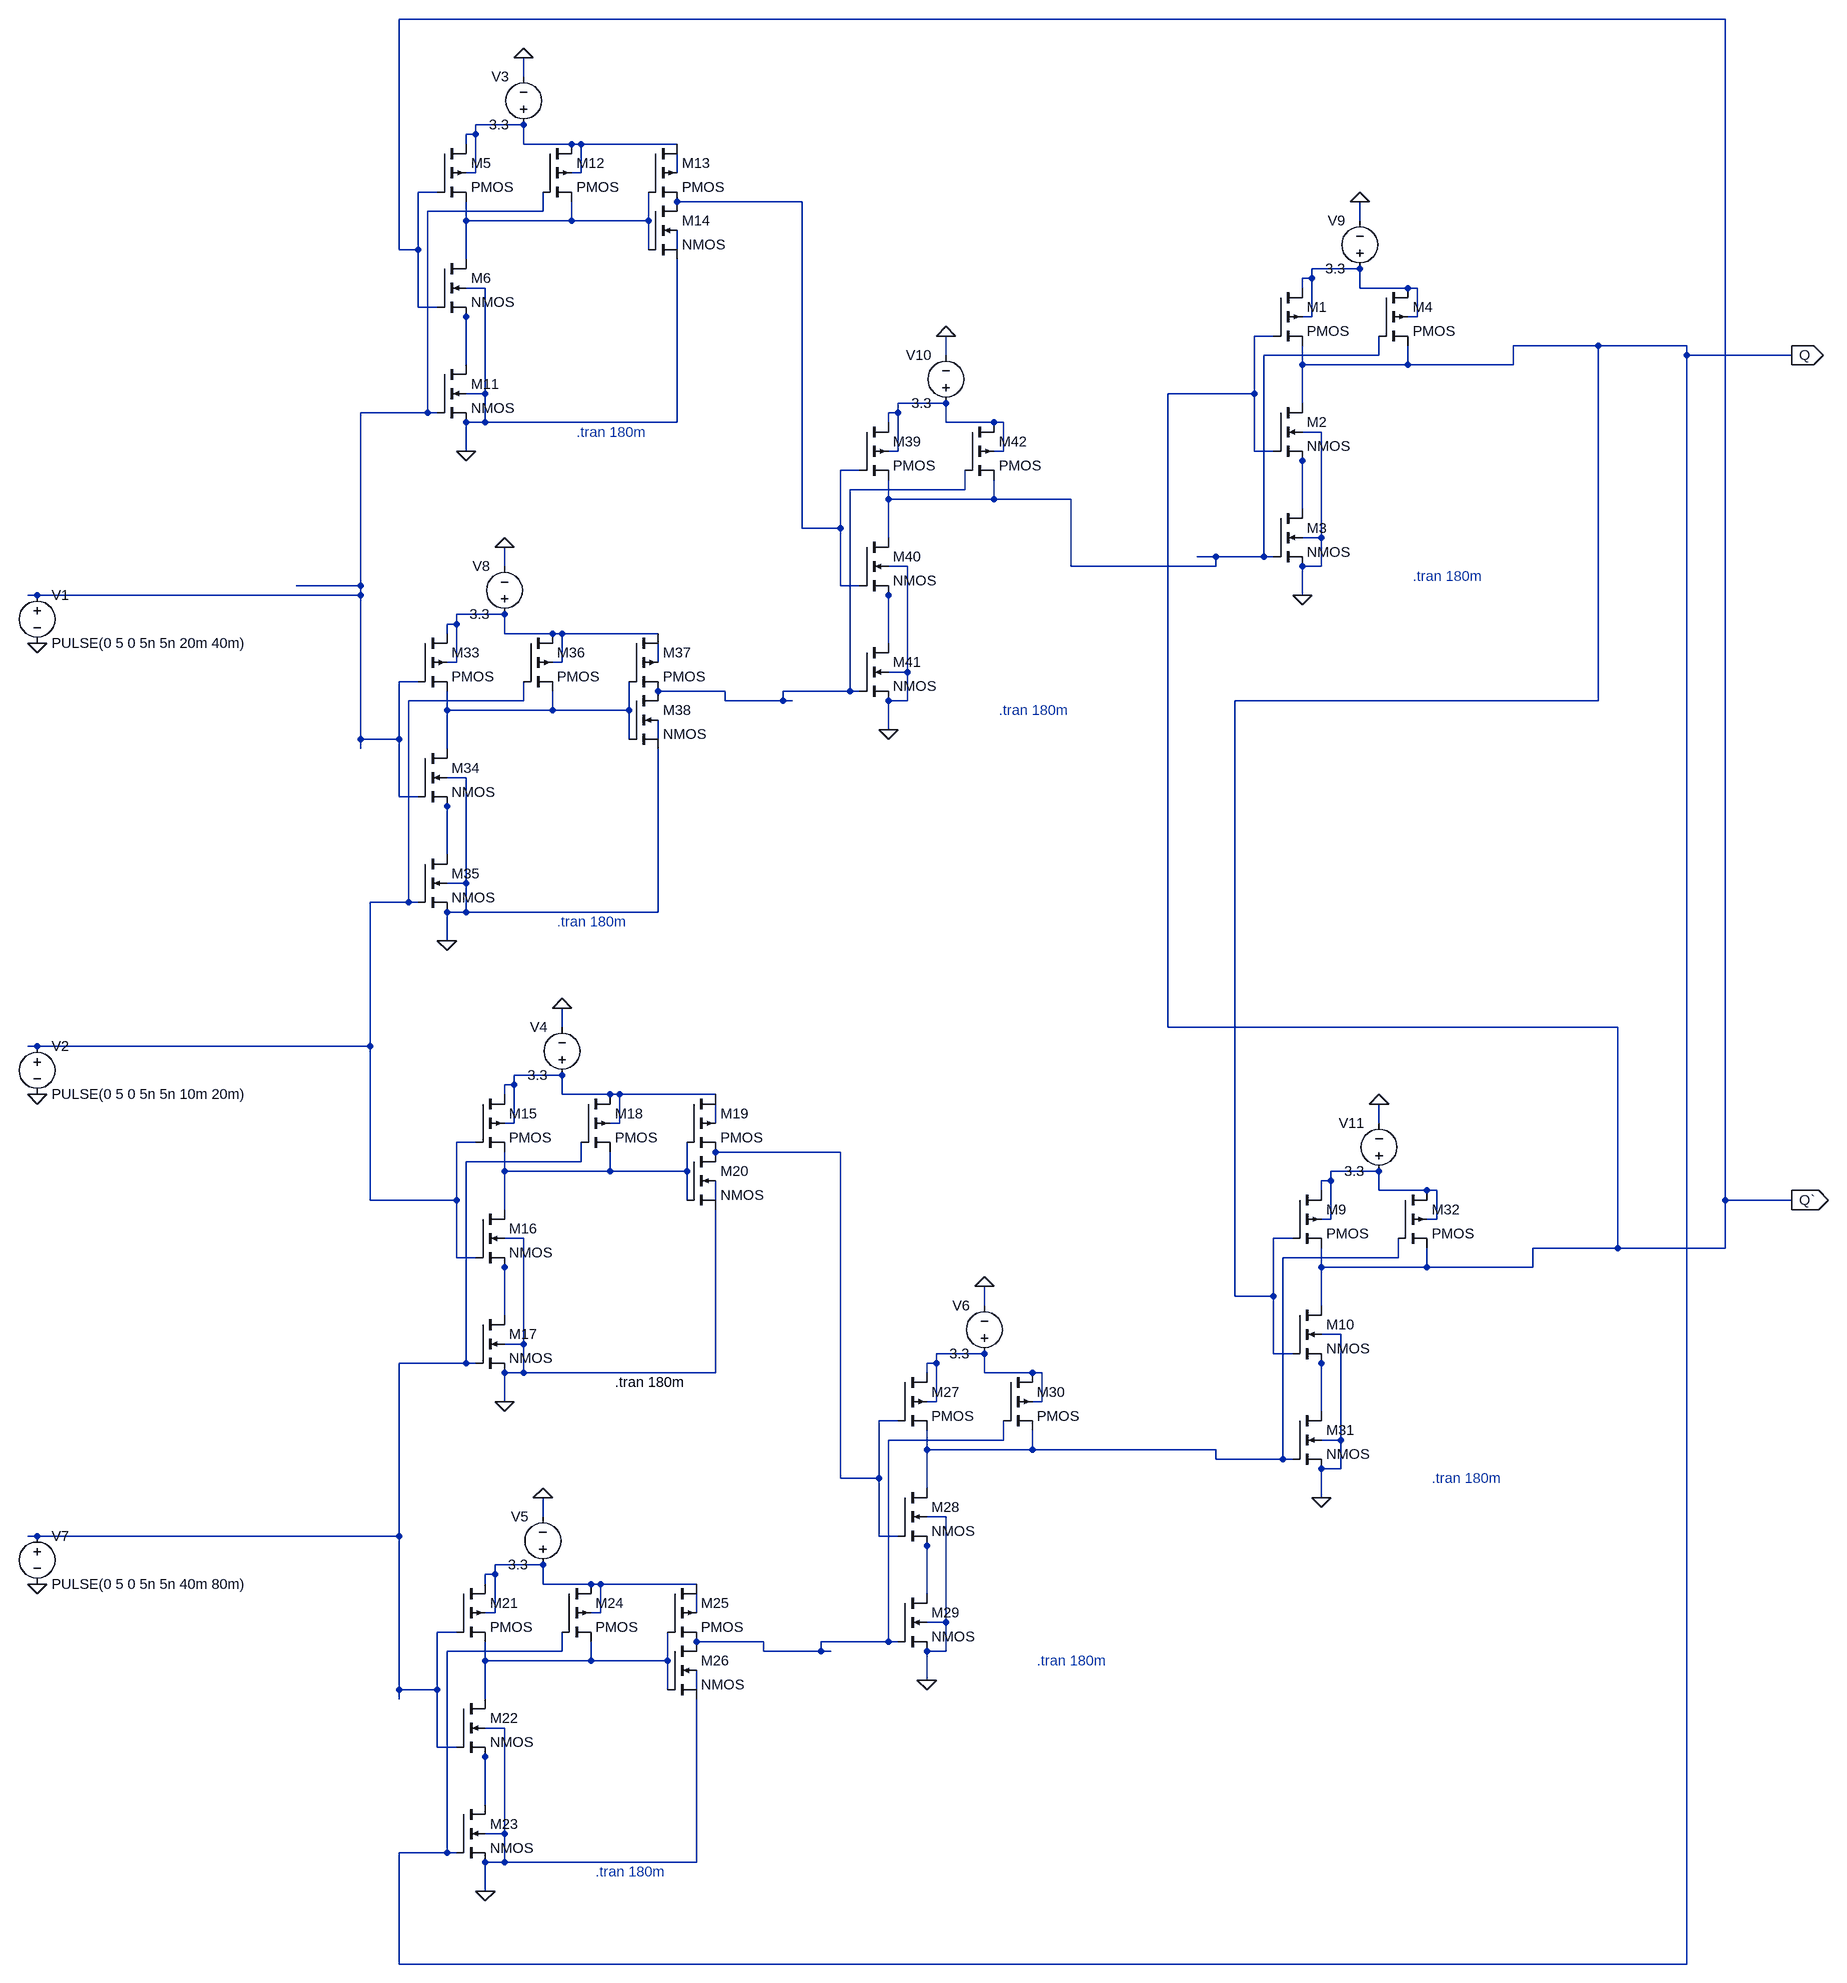
[diagram p0: schematic JKFF.asc]
JKFF.asc, the LTspice schematic file:
Version 4
SHEET 1 1068 2212
WIRE 784 -1152 -1664 -1152
WIRE -1456 -1056 -1456 -1088
WIRE -1456 -976 -1536 -976
WIRE -1536 -960 -1536 -976
WIRE -1536 -960 -1552 -960
WIRE -1552 -944 -1552 -960
WIRE -1456 -944 -1456 -976
WIRE -1376 -944 -1456 -944
WIRE -1360 -944 -1376 -944
WIRE -1200 -944 -1360 -944
WIRE -1536 -896 -1536 -960
WIRE -1536 -896 -1552 -896
WIRE -1360 -896 -1360 -944
WIRE -1360 -896 -1376 -896
WIRE -1200 -896 -1200 -928
WIRE -1600 -864 -1632 -864
WIRE -992 -848 -1200 -848
WIRE -1424 -832 -1424 -864
WIRE -1424 -832 -1616 -832
WIRE -1552 -816 -1552 -848
WIRE -1376 -816 -1376 -848
WIRE -1376 -816 -1552 -816
WIRE -1248 -816 -1248 -864
WIRE -1248 -816 -1376 -816
WIRE 48 -816 48 -848
WIRE -1664 -768 -1664 -1152
WIRE -1632 -768 -1632 -864
WIRE -1632 -768 -1664 -768
WIRE -1248 -768 -1248 -816
WIRE -1200 -768 -1200 -800
WIRE -1552 -752 -1552 -816
WIRE 48 -736 -32 -736
WIRE -32 -720 -32 -736
WIRE -32 -720 -48 -720
WIRE -1520 -704 -1552 -704
WIRE -48 -704 -48 -720
WIRE 48 -704 48 -736
WIRE 128 -704 48 -704
WIRE 144 -704 128 -704
WIRE -1632 -672 -1632 -768
WIRE -1600 -672 -1632 -672
WIRE -1552 -656 -1552 -672
WIRE -32 -656 -32 -720
WIRE -32 -656 -48 -656
WIRE 144 -656 144 -704
WIRE 144 -656 128 -656
WIRE -96 -624 -128 -624
WIRE 544 -608 304 -608
WIRE 720 -608 544 -608
WIRE -752 -592 -752 -624
WIRE 80 -592 80 -624
WIRE 80 -592 -112 -592
WIRE 720 -592 720 -608
WIRE 976 -592 720 -592
WIRE -1552 -576 -1552 -656
WIRE -48 -576 -48 -608
WIRE 128 -576 128 -608
WIRE 128 -576 -48 -576
WIRE 304 -576 304 -608
WIRE 304 -576 128 -576
WIRE -1520 -528 -1520 -704
WIRE -1520 -528 -1552 -528
WIRE -128 -528 -128 -624
WIRE -128 -528 -272 -528
WIRE -752 -512 -832 -512
WIRE -48 -512 -48 -576
WIRE -1616 -496 -1616 -832
WIRE -1616 -496 -1728 -496
WIRE -1600 -496 -1616 -496
WIRE -832 -496 -832 -512
WIRE -832 -496 -848 -496
WIRE -1520 -480 -1520 -528
WIRE -1520 -480 -1552 -480
WIRE -1200 -480 -1200 -752
WIRE -1200 -480 -1520 -480
WIRE -848 -480 -848 -496
WIRE -752 -480 -752 -512
WIRE -672 -480 -752 -480
WIRE -656 -480 -672 -480
WIRE -16 -464 -48 -464
WIRE -1552 -432 -1552 -480
WIRE -832 -432 -832 -496
WIRE -832 -432 -848 -432
WIRE -656 -432 -656 -480
WIRE -656 -432 -672 -432
WIRE -128 -432 -128 -528
WIRE -96 -432 -128 -432
WIRE -48 -416 -48 -432
WIRE -896 -400 -928 -400
WIRE -720 -368 -720 -400
WIRE -720 -368 -912 -368
WIRE -848 -352 -848 -384
WIRE -672 -352 -672 -384
WIRE -672 -352 -848 -352
WIRE -544 -352 -672 -352
WIRE -48 -336 -48 -416
WIRE -992 -304 -992 -848
WIRE -928 -304 -928 -400
WIRE -928 -304 -992 -304
WIRE -848 -288 -848 -352
WIRE -16 -288 -16 -464
WIRE -16 -288 -48 -288
WIRE -192 -256 -224 -256
WIRE -112 -256 -112 -592
WIRE -112 -256 -192 -256
WIRE -96 -256 -112 -256
WIRE -1488 -240 -1488 -272
WIRE -816 -240 -848 -240
WIRE -544 -240 -544 -352
WIRE -192 -240 -192 -256
WIRE -192 -240 -544 -240
WIRE -16 -240 -16 -288
WIRE -16 -240 -48 -240
WIRE -1728 -208 -1728 -496
WIRE -1728 -208 -1840 -208
WIRE -928 -208 -928 -304
WIRE -896 -208 -928 -208
WIRE -2272 -192 -2288 -192
WIRE -1728 -192 -1728 -208
WIRE -1728 -192 -2272 -192
WIRE -848 -192 -848 -208
WIRE -48 -192 -48 -240
WIRE -1488 -160 -1568 -160
WIRE -1568 -144 -1568 -160
WIRE -1568 -144 -1584 -144
WIRE -1584 -128 -1584 -144
WIRE -1488 -128 -1488 -160
WIRE -1408 -128 -1488 -128
WIRE -1392 -128 -1408 -128
WIRE -1232 -128 -1392 -128
WIRE -848 -112 -848 -192
WIRE -1568 -80 -1568 -144
WIRE -1568 -80 -1584 -80
WIRE -1392 -80 -1392 -128
WIRE -1392 -80 -1408 -80
WIRE -1232 -80 -1232 -112
WIRE -816 -64 -816 -240
WIRE -816 -64 -848 -64
WIRE -1632 -48 -1664 -48
WIRE -1120 -32 -1232 -32
WIRE -912 -32 -912 -368
WIRE -912 -32 -1024 -32
WIRE -896 -32 -912 -32
WIRE -1456 -16 -1456 -48
WIRE -1456 -16 -1648 -16
WIRE -1120 -16 -1120 -32
WIRE -1024 -16 -1024 -32
WIRE -1024 -16 -1120 -16
WIRE -1008 -16 -1024 -16
WIRE -816 -16 -816 -64
WIRE -816 -16 -848 -16
WIRE 544 -16 544 -608
WIRE 544 -16 -160 -16
WIRE -1584 0 -1584 -32
WIRE -1408 0 -1408 -32
WIRE -1408 0 -1584 0
WIRE -1280 0 -1280 -48
WIRE -1280 0 -1408 0
WIRE -848 32 -848 -16
WIRE -1728 48 -1728 -192
WIRE -1664 48 -1664 -48
WIRE -1664 48 -1728 48
WIRE -1280 48 -1280 0
WIRE -1232 48 -1232 16
WIRE -1728 64 -1728 48
WIRE -1584 64 -1584 0
WIRE -1552 112 -1584 112
WIRE -1664 144 -1664 48
WIRE -1632 144 -1664 144
WIRE -1584 160 -1584 144
WIRE -1584 240 -1584 160
WIRE -1552 288 -1552 112
WIRE -1552 288 -1584 288
WIRE -1648 320 -1648 -16
WIRE -1648 320 -1712 320
WIRE -1632 320 -1648 320
WIRE -1552 336 -1552 288
WIRE -1552 336 -1584 336
WIRE -1232 336 -1232 64
WIRE -1232 336 -1552 336
WIRE -1584 384 -1584 336
WIRE -1392 528 -1392 496
WIRE -272 528 -272 -528
WIRE 576 528 -272 528
WIRE -2272 560 -2288 560
WIRE -1712 560 -1712 320
WIRE -1712 560 -2272 560
WIRE -1392 608 -1472 608
WIRE -1472 624 -1472 608
WIRE -1472 624 -1488 624
WIRE -1488 640 -1488 624
WIRE -1392 640 -1392 608
WIRE -1312 640 -1392 640
WIRE -1296 640 -1312 640
WIRE -1136 640 -1296 640
WIRE -1472 688 -1472 624
WIRE -1472 688 -1488 688
WIRE -1296 688 -1296 640
WIRE -1296 688 -1312 688
WIRE -1136 688 -1136 656
WIRE 80 688 80 656
WIRE -1536 720 -1568 720
WIRE -928 736 -1136 736
WIRE -1360 752 -1360 720
WIRE -1360 752 -1552 752
WIRE -1488 768 -1488 736
WIRE -1312 768 -1312 736
WIRE -1312 768 -1488 768
WIRE -1184 768 -1184 720
WIRE -1184 768 -1312 768
WIRE 80 768 0 768
WIRE 0 784 0 768
WIRE 0 784 -16 784
WIRE -16 800 -16 784
WIRE 80 800 80 768
WIRE 160 800 80 800
WIRE 176 800 160 800
WIRE -1712 816 -1712 560
WIRE -1568 816 -1568 720
WIRE -1568 816 -1712 816
WIRE -1184 816 -1184 768
WIRE -1136 816 -1136 784
WIRE 784 816 784 -1152
WIRE 976 816 784 816
WIRE -1488 832 -1488 768
WIRE 0 848 0 784
WIRE 0 848 -16 848
WIRE 176 848 176 800
WIRE 176 848 160 848
WIRE -1456 880 -1488 880
WIRE -64 880 -96 880
WIRE 576 896 576 528
WIRE 576 896 336 896
WIRE 784 896 784 816
WIRE 784 896 576 896
WIRE -1568 912 -1568 816
WIRE -1536 912 -1568 912
WIRE 112 912 112 880
WIRE 112 912 -80 912
WIRE -1488 928 -1488 912
WIRE -16 928 -16 896
WIRE 160 928 160 896
WIRE 160 928 -16 928
WIRE 336 928 336 896
WIRE 336 928 160 928
WIRE -160 976 -160 -16
WIRE -96 976 -96 880
WIRE -96 976 -160 976
WIRE -688 992 -688 960
WIRE -16 992 -16 928
WIRE -1488 1008 -1488 928
WIRE 16 1040 -16 1040
WIRE -1456 1056 -1456 880
WIRE -1456 1056 -1488 1056
WIRE -688 1072 -768 1072
WIRE -96 1072 -96 976
WIRE -64 1072 -96 1072
WIRE -1552 1088 -1552 752
WIRE -1552 1088 -1664 1088
WIRE -1536 1088 -1552 1088
WIRE -768 1088 -768 1072
WIRE -768 1088 -784 1088
WIRE -16 1088 -16 1072
WIRE -1456 1104 -1456 1056
WIRE -1456 1104 -1488 1104
WIRE -1136 1104 -1136 832
WIRE -1136 1104 -1456 1104
WIRE -784 1104 -784 1088
WIRE -688 1104 -688 1072
WIRE -608 1104 -688 1104
WIRE -592 1104 -608 1104
WIRE -1488 1152 -1488 1104
WIRE -768 1152 -768 1088
WIRE -768 1152 -784 1152
WIRE -592 1152 -592 1104
WIRE -592 1152 -608 1152
WIRE -16 1168 -16 1088
WIRE -832 1184 -864 1184
WIRE -656 1216 -656 1184
WIRE -656 1216 -848 1216
WIRE 16 1216 16 1040
WIRE 16 1216 -16 1216
WIRE -784 1232 -784 1200
WIRE -608 1232 -608 1200
WIRE -608 1232 -784 1232
WIRE -192 1232 -608 1232
WIRE -192 1248 -192 1232
WIRE -80 1248 -80 912
WIRE -80 1248 -192 1248
WIRE -64 1248 -80 1248
WIRE 16 1264 16 1216
WIRE 16 1264 -16 1264
WIRE -928 1280 -928 736
WIRE -864 1280 -864 1184
WIRE -864 1280 -928 1280
WIRE -784 1296 -784 1232
WIRE -16 1312 -16 1264
WIRE -1424 1344 -1424 1312
WIRE -752 1344 -784 1344
WIRE -2272 1376 -2288 1376
WIRE -1664 1376 -1664 1088
WIRE -1664 1376 -2272 1376
WIRE -864 1376 -864 1280
WIRE -832 1376 -864 1376
WIRE -784 1392 -784 1376
WIRE -1424 1424 -1504 1424
WIRE -1504 1440 -1504 1424
WIRE -1504 1440 -1520 1440
WIRE -1520 1456 -1520 1440
WIRE -1424 1456 -1424 1424
WIRE -1344 1456 -1424 1456
WIRE -1328 1456 -1344 1456
WIRE -1168 1456 -1328 1456
WIRE -784 1472 -784 1392
WIRE -1504 1504 -1504 1440
WIRE -1504 1504 -1520 1504
WIRE -1328 1504 -1328 1456
WIRE -1328 1504 -1344 1504
WIRE -1168 1504 -1168 1472
WIRE -752 1520 -752 1344
WIRE -752 1520 -784 1520
WIRE -1568 1536 -1600 1536
WIRE -1056 1552 -1168 1552
WIRE -848 1552 -848 1216
WIRE -848 1552 -960 1552
WIRE -832 1552 -848 1552
WIRE -1392 1568 -1392 1536
WIRE -1392 1568 -1584 1568
WIRE -1056 1568 -1056 1552
WIRE -960 1568 -960 1552
WIRE -960 1568 -1056 1568
WIRE -944 1568 -960 1568
WIRE -752 1568 -752 1520
WIRE -752 1568 -784 1568
WIRE -1520 1584 -1520 1552
WIRE -1344 1584 -1344 1552
WIRE -1344 1584 -1520 1584
WIRE -1216 1584 -1216 1536
WIRE -1216 1584 -1344 1584
WIRE -784 1616 -784 1568
WIRE -1664 1632 -1664 1376
WIRE -1600 1632 -1600 1536
WIRE -1600 1632 -1664 1632
WIRE -1216 1632 -1216 1584
WIRE -1168 1632 -1168 1600
WIRE -1664 1648 -1664 1632
WIRE -1520 1648 -1520 1584
WIRE -1488 1696 -1520 1696
WIRE -1600 1728 -1600 1632
WIRE -1568 1728 -1600 1728
WIRE -1520 1744 -1520 1728
WIRE -1520 1824 -1520 1744
WIRE -1488 1872 -1488 1696
WIRE -1488 1872 -1520 1872
WIRE -1584 1904 -1584 1568
WIRE -1584 1904 -1664 1904
WIRE -1568 1904 -1584 1904
WIRE -1488 1920 -1488 1872
WIRE -1488 1920 -1520 1920
WIRE -1168 1920 -1168 1648
WIRE -1168 1920 -1488 1920
WIRE -1520 1968 -1520 1920
WIRE -1664 2208 -1664 1904
WIRE 720 2208 720 -592
WIRE 720 2208 -1664 2208
FLAG -1488 1152 0
FLAG -1392 496 0
FLAG -1520 1968 0
FLAG -1424 1312 0
FLAG -784 1616 0
FLAG -688 960 0
FLAG -1552 -432 0
FLAG -1456 -1088 0
FLAG -1584 384 0
FLAG -1488 -272 0
FLAG -848 32 0
FLAG -752 -624 0
FLAG -48 -192 0
FLAG 48 -848 0
FLAG -16 1312 0
FLAG 80 656 0
FLAG -2272 -112 0
FLAG -2272 640 0
FLAG 976 -592 Q
IOPIN 976 -592 Out
FLAG 976 816 Q`
IOPIN 976 816 Out
FLAG -2272 1456 0
SYMBOL pmos4 -1536 640 R0
SYMATTR InstName M15
SYMATTR Value2 l=1040nm w=1040nm
SYMBOL nmos4 -1536 832 R0
SYMATTR InstName M16
SYMATTR Value2 l=1040nm w=1040nm
SYMBOL nmos4 -1536 1008 R0
SYMATTR InstName M17
SYMATTR Value2 l=1040nm w=1040nm
SYMBOL voltage -1392 624 R180
WINDOW 0 24 96 Left 2
WINDOW 3 24 16 Left 2
WINDOW 123 0 0 Left 0
WINDOW 39 0 0 Left 0
SYMATTR InstName V4
SYMATTR Value 3.3
SYMBOL pmos4 -1360 640 R0
SYMATTR InstName M18
SYMBOL pmos4 -1184 640 R0
SYMATTR InstName M19
SYMBOL nmos4 -1184 736 R0
SYMATTR InstName M20
SYMBOL pmos4 -1568 1456 R0
SYMATTR InstName M21
SYMATTR Value2 l=1040nm w=1040nm
SYMBOL nmos4 -1568 1648 R0
SYMATTR InstName M22
SYMATTR Value2 l=1040nm w=1040nm
SYMBOL nmos4 -1568 1824 R0
SYMATTR InstName M23
SYMATTR Value2 l=1040nm w=1040nm
SYMBOL voltage -1424 1440 R180
WINDOW 0 24 96 Left 2
WINDOW 3 24 16 Left 2
WINDOW 123 0 0 Left 0
WINDOW 39 0 0 Left 0
SYMATTR InstName V5
SYMATTR Value 3.3
SYMBOL pmos4 -1392 1456 R0
SYMATTR InstName M24
SYMBOL pmos4 -1216 1456 R0
SYMATTR InstName M25
SYMBOL nmos4 -1216 1552 R0
SYMATTR InstName M26
SYMBOL pmos4 -832 1104 R0
SYMATTR InstName M27
SYMATTR Value2 l=1040nm w=1040nm
SYMBOL nmos4 -832 1296 R0
SYMATTR InstName M28
SYMATTR Value2 l=1040nm w=1040nm
SYMBOL nmos4 -832 1472 R0
SYMATTR InstName M29
SYMATTR Value2 l=1040nm w=1040nm
SYMBOL voltage -688 1088 R180
WINDOW 0 24 96 Left 2
WINDOW 3 24 16 Left 2
WINDOW 123 0 0 Left 0
WINDOW 39 0 0 Left 0
SYMATTR InstName V6
SYMATTR Value 3.3
SYMBOL pmos4 -656 1104 R0
SYMATTR InstName M30
SYMBOL pmos4 -1600 -944 R0
SYMATTR InstName M5
SYMATTR Value2 l=1040nm w=1040nm
SYMBOL nmos4 -1600 -752 R0
SYMATTR InstName M6
SYMATTR Value2 l=1040nm w=1040nm
SYMBOL nmos4 -1600 -576 R0
SYMATTR InstName M11
SYMATTR Value2 l=1040nm w=1040nm
SYMBOL voltage -1456 -960 R180
WINDOW 0 24 96 Left 2
WINDOW 3 24 16 Left 2
WINDOW 123 0 0 Left 0
WINDOW 39 0 0 Left 0
SYMATTR InstName V3
SYMATTR Value 3.3
SYMBOL pmos4 -1424 -944 R0
SYMATTR InstName M12
SYMBOL pmos4 -1248 -944 R0
SYMATTR InstName M13
SYMBOL nmos4 -1248 -848 R0
SYMATTR InstName M14
SYMBOL pmos4 -1632 -128 R0
SYMATTR InstName M33
SYMATTR Value2 l=1040nm w=1040nm
SYMBOL nmos4 -1632 64 R0
SYMATTR InstName M34
SYMATTR Value2 l=1040nm w=1040nm
SYMBOL nmos4 -1632 240 R0
SYMATTR InstName M35
SYMATTR Value2 l=1040nm w=1040nm
SYMBOL voltage -1488 -144 R180
WINDOW 0 24 96 Left 2
WINDOW 3 24 16 Left 2
WINDOW 123 0 0 Left 0
WINDOW 39 0 0 Left 0
SYMATTR InstName V8
SYMATTR Value 3.3
SYMBOL pmos4 -1456 -128 R0
SYMATTR InstName M36
SYMBOL pmos4 -1280 -128 R0
SYMATTR InstName M37
SYMBOL nmos4 -1280 -32 R0
SYMATTR InstName M38
SYMBOL pmos4 -896 -480 R0
SYMATTR InstName M39
SYMATTR Value2 l=1040nm w=1040nm
SYMBOL nmos4 -896 -288 R0
SYMATTR InstName M40
SYMATTR Value2 l=1040nm w=1040nm
SYMBOL nmos4 -896 -112 R0
SYMATTR InstName M41
SYMATTR Value2 l=1040nm w=1040nm
SYMBOL voltage -752 -496 R180
WINDOW 0 24 96 Left 2
WINDOW 3 24 16 Left 2
WINDOW 123 0 0 Left 0
WINDOW 39 0 0 Left 0
SYMATTR InstName V10
SYMATTR Value 3.3
SYMBOL pmos4 -720 -480 R0
SYMATTR InstName M42
SYMBOL pmos4 -96 -704 R0
SYMATTR InstName M1
SYMATTR Value2 l=1040nm w=1040nm
SYMBOL nmos4 -96 -512 R0
SYMATTR InstName M2
SYMATTR Value2 l=1040nm w=1040nm
SYMBOL nmos4 -96 -336 R0
SYMATTR InstName M3
SYMATTR Value2 l=1040nm w=1040nm
SYMBOL voltage 48 -720 R180
WINDOW 0 24 96 Left 2
WINDOW 3 24 16 Left 2
WINDOW 123 0 0 Left 0
WINDOW 39 0 0 Left 0
SYMATTR InstName V9
SYMATTR Value 3.3
SYMBOL pmos4 80 -704 R0
SYMATTR InstName M4
SYMBOL pmos4 -64 800 R0
SYMATTR InstName M9
SYMATTR Value2 l=1040nm w=1040nm
SYMBOL nmos4 -64 992 R0
SYMATTR InstName M10
SYMATTR Value2 l=1040nm w=1040nm
SYMBOL nmos4 -64 1168 R0
SYMATTR InstName M31
SYMATTR Value2 l=1040nm w=1040nm
SYMBOL voltage 80 784 R180
WINDOW 0 24 96 Left 2
WINDOW 3 24 16 Left 2
WINDOW 123 0 0 Left 0
WINDOW 39 0 0 Left 0
SYMATTR InstName V11
SYMATTR Value 3.3
SYMBOL pmos4 112 800 R0
SYMATTR InstName M32
SYMBOL voltage -2272 -208 R0
WINDOW 123 0 0 Left 0
WINDOW 39 0 0 Left 0
SYMATTR InstName V1
SYMATTR Value PULSE(0 5 0 5n 5n 20m 40m)
SYMBOL voltage -2272 544 R0
WINDOW 123 0 0 Left 0
WINDOW 39 0 0 Left 0
SYMATTR InstName V2
SYMATTR Value PULSE(0 5 0 5n 5n 10m 20m)
SYMBOL voltage -2272 1360 R0
WINDOW 123 0 0 Left 0
WINDOW 39 0 0 Left 0
SYMATTR InstName V7
SYMATTR Value PULSE(0 5 0 5n 5n 40m 80m)
TEXT -1304 1120 Left 2 !.tran 180m
TEXT -1336 1936 Left 2 ;.tran 180m
TEXT -600 1584 Left 2 ;.tran 180m
TEXT -1368 -464 Left 2 ;.tran 180m
TEXT -1400 352 Left 2 ;.tran 180m
TEXT -664 0 Left 2 ;.tran 180m
TEXT 136 -224 Left 2 ;.tran 180m
TEXT 168 1280 Left 2 ;.tran 180m

The netlist it stands for:
* JKFF.asc
M15 N020 N016 N024 N020 PMOS l=1040nm w=1040nm
M16 N024 N016 N028 0 NMOS l=1040nm w=1040nm
M17 N028 N023 0 0 NMOS l=1040nm w=1040nm
V4 N020 0 3.3
M18 N020 N023 N024 N020 PMOS
M19 N020 N024 N022 N021 PMOS
M20 N022 N024 0 N026 NMOS
M21 N033 N023 N035 N033 PMOS l=1040nm w=1040nm
M22 N035 N023 N037 0 NMOS l=1040nm w=1040nm
M23 N037 Q 0 0 NMOS l=1040nm w=1040nm
V5 N033 0 3.3
M24 N033 Q N035 N033 PMOS
M25 N033 N035 N031 N034 PMOS
M26 N031 N035 0 N036 NMOS
M27 N029 N022 N027 N029 PMOS l=1040nm w=1040nm
M28 N027 N022 N032 0 NMOS l=1040nm w=1040nm
M29 N032 N031 0 0 NMOS l=1040nm w=1040nm
V6 N029 0 3.3
M30 N029 N031 N027 N029 PMOS
M5 N001 Q` N005 N001 PMOS l=1040nm w=1040nm
M6 N005 Q` N008 0 NMOS l=1040nm w=1040nm
M11 N008 N004 0 0 NMOS l=1040nm w=1040nm
V3 N001 0 3.3
M12 N001 N004 N005 N001 PMOS
M13 N001 N005 N003 N002 PMOS
M14 N003 N005 0 N006 NMOS
M33 N014 N004 N017 N014 PMOS l=1040nm w=1040nm
M34 N017 N004 N019 0 NMOS l=1040nm w=1040nm
M35 N019 N016 0 0 NMOS l=1040nm w=1040nm
V8 N014 0 3.3
M36 N014 N016 N017 N014 PMOS
M37 N014 N017 N012 N015 PMOS
M38 N012 N017 0 N018 NMOS
M39 N010 N003 N009 N010 PMOS l=1040nm w=1040nm
M40 N009 N003 N013 0 NMOS l=1040nm w=1040nm
M41 N013 N012 0 0 NMOS l=1040nm w=1040nm
V10 N010 0 3.3
M42 N010 N012 N009 N010 PMOS
M1 N007 Q` Q N007 PMOS l=1040nm w=1040nm
M2 Q Q` N011 0 NMOS l=1040nm w=1040nm
M3 N011 N009 0 0 NMOS l=1040nm w=1040nm
V9 N007 0 3.3
M4 N007 N009 Q N007 PMOS
M9 N025 Q Q` N025 PMOS l=1040nm w=1040nm
M10 Q` Q N030 0 NMOS l=1040nm w=1040nm
M31 N030 N027 0 0 NMOS l=1040nm w=1040nm
V11 N025 0 3.3
M32 N025 N027 Q` N025 PMOS
V1 N004 0 PULSE(0 5 0 5n 5n 20m 40m)
V2 N016 0 PULSE(0 5 0 5n 5n 10m 20m)
V7 N023 0 PULSE(0 5 0 5n 5n 40m 80m)
.model NMOS NMOS
.model PMOS PMOS
.lib standard.mos
.tran 180m
* .tran 180m
* .tran 180m
* .tran 180m
* .tran 180m
* .tran 180m
* .tran 180m
* .tran 180m
.backanno
.end